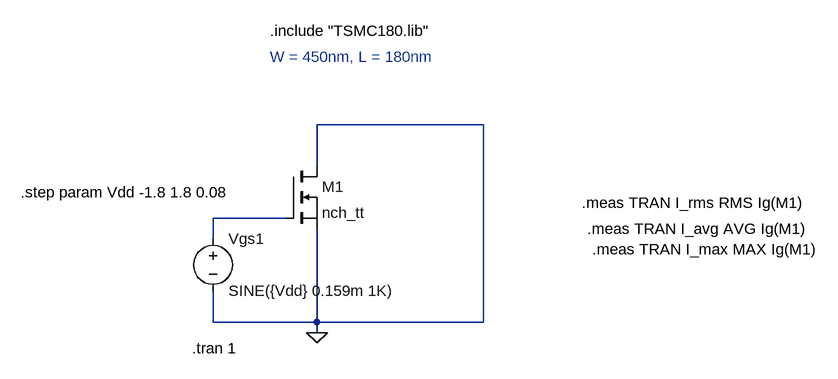
[diagram p0: schematic Q2_nmos_sc.asc]
Q2_nmos_sc.asc, the LTspice schematic file:
Version 4
SHEET 1 892 680
WIRE 352 64 96 64
WIRE 96 128 96 64
WIRE 48 208 -64 208
WIRE -64 240 -64 208
WIRE -64 368 -64 320
WIRE 96 368 96 224
WIRE 96 368 -64 368
WIRE 352 368 352 64
WIRE 352 368 96 368
WIRE 96 384 96 368
FLAG 96 384 0
SYMBOL nmos 48 128 R0
SYMATTR InstName M1
SYMATTR Value nch_tt
SYMATTR Value2 W=450n L=180n
SYMBOL voltage -64 224 R0
WINDOW 123 0 0 Left 0
WINDOW 39 0 0 Left 0
SYMATTR InstName Vgs1
SYMATTR Value SINE({Vdd} 0.159m 1K)
TEXT 24 -80 Left 2 !.include "TSMC180.lib"
TEXT 24 -40 Left 2 ;W = 450nm, L = 180nm
TEXT -96 408 Left 2 !.tran 1
TEXT -360 168 Left 2 !.step param Vdd -1.8 1.8 0.08
TEXT 504 184 Left 2 !.meas TRAN I_rms RMS Ig(M1)
TEXT 512 224 Left 2 !.meas TRAN I_avg AVG Ig(M1)
TEXT 520 256 Left 2 !.meas TRAN I_max MAX Ig(M1)

The netlist it stands for:
* Q2_nmos_sc.asc
M1 0 N001 0 0 nch_tt W=450n L=180n
Vgs1 N001 0 SINE({Vdd} 0.159m 1K)
.model NMOS NMOS
.model PMOS PMOS
.lib standard.mos
.include "TSMC180.lib"
* W = 450nm, L = 180nm
.tran 1
.step param Vdd -1.8 1.8 0.08
.meas TRAN I_rms RMS Ig(M1)
.meas TRAN I_avg AVG Ig(M1)
.meas TRAN I_max MAX Ig(M1)
.backanno
.end